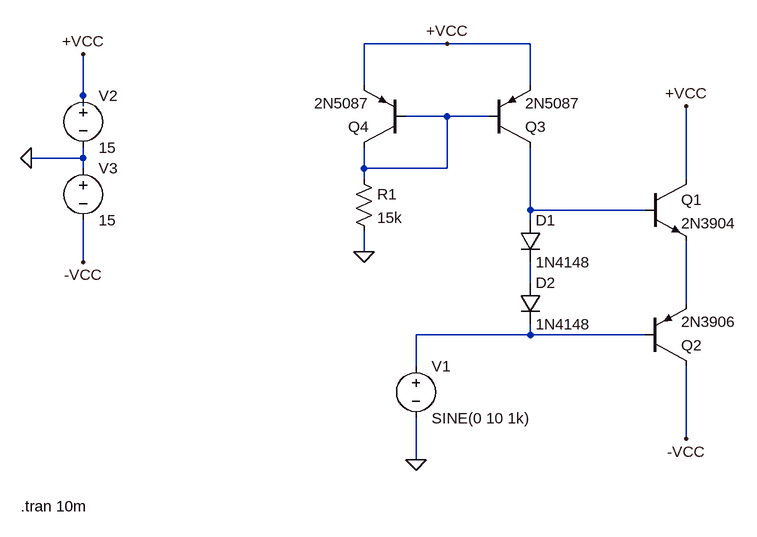
[diagram p0: schematic estagio_potencia.asc]
estagio_potencia.asc, the LTspice schematic file:
Version 4.1
SHEET 1 880 692
WIRE -144 -112 -272 -112
WIRE -16 -112 -144 -112
WIRE -272 -48 -272 -112
WIRE -16 -48 -16 -112
WIRE -704 -32 -704 -96
WIRE -704 -16 -704 -32
WIRE -144 0 -208 0
WIRE -80 0 -144 0
WIRE -704 64 -704 48
WIRE -704 64 -784 64
WIRE -704 80 -704 64
WIRE -272 80 -272 48
WIRE -144 80 -144 0
WIRE -144 80 -272 80
WIRE -272 96 -272 80
WIRE 224 96 224 -16
WIRE -16 144 -16 48
WIRE 160 144 -16 144
WIRE -16 160 -16 144
WIRE -272 208 -272 176
WIRE -704 224 -704 160
WIRE -16 256 -16 224
WIRE 224 288 224 192
WIRE -16 336 -16 320
WIRE -16 336 -192 336
WIRE 160 336 -16 336
WIRE -192 384 -192 336
WIRE 224 496 224 384
WIRE -192 528 -192 464
FLAG 224 -16 +VCC
FLAG 224 496 -VCC
FLAG -272 208 0
FLAG -192 528 0
FLAG -144 -112 +VCC
FLAG -784 64 0
FLAG -704 -96 +VCC
FLAG -704 224 -VCC
SYMBOL diode -32 160 R0
SYMATTR InstName D1
SYMATTR Value 1N4148
SYMBOL diode -32 256 R0
SYMATTR InstName D2
SYMATTR Value 1N4148
SYMBOL npn 160 96 R0
SYMATTR InstName Q1
SYMATTR Value 2N3904
SYMBOL pnp 160 384 M180
SYMATTR InstName Q2
SYMATTR Value 2N3906
SYMBOL pnp -80 48 M180
SYMATTR InstName Q3
SYMATTR Value 2N5087
SYMBOL pnp -208 48 R180
SYMATTR InstName Q4
SYMATTR Value 2N5087
SYMBOL res -288 80 R0
SYMATTR InstName R1
SYMATTR Value 15k
SYMBOL voltage -192 368 R0
WINDOW 123 0 0 Left 0
WINDOW 39 0 0 Left 0
SYMATTR InstName V1
SYMATTR Value SINE(0 10 1k)
SYMBOL voltage -704 -48 R0
WINDOW 123 0 0 Left 0
WINDOW 39 0 0 Left 0
SYMATTR InstName V2
SYMATTR Value 15
SYMBOL voltage -704 64 R0
WINDOW 123 0 0 Left 0
WINDOW 39 0 0 Left 0
SYMATTR InstName V3
SYMATTR Value 15
TEXT -800 600 Left 2 !.tran 10m

The netlist it stands for:
* estagio_potencia.asc
D1 N002 N003 1N4148
D2 N003 N005 1N4148
Q1 +VCC N002 N004 0 2N3904
Q2 -VCC N005 N004 0 2N3906
Q3 N002 N001 +VCC 0 2N5087
Q4 N001 N001 +VCC 0 2N5087
R1 N001 0 15k
V1 N005 0 SINE(0 10 1k)
V2 +VCC 0 15
V3 0 -VCC 15
.model D D
.lib standard.dio
.model NPN NPN
.model PNP PNP
.lib standard.bjt
.tran 10m
.backanno
.end